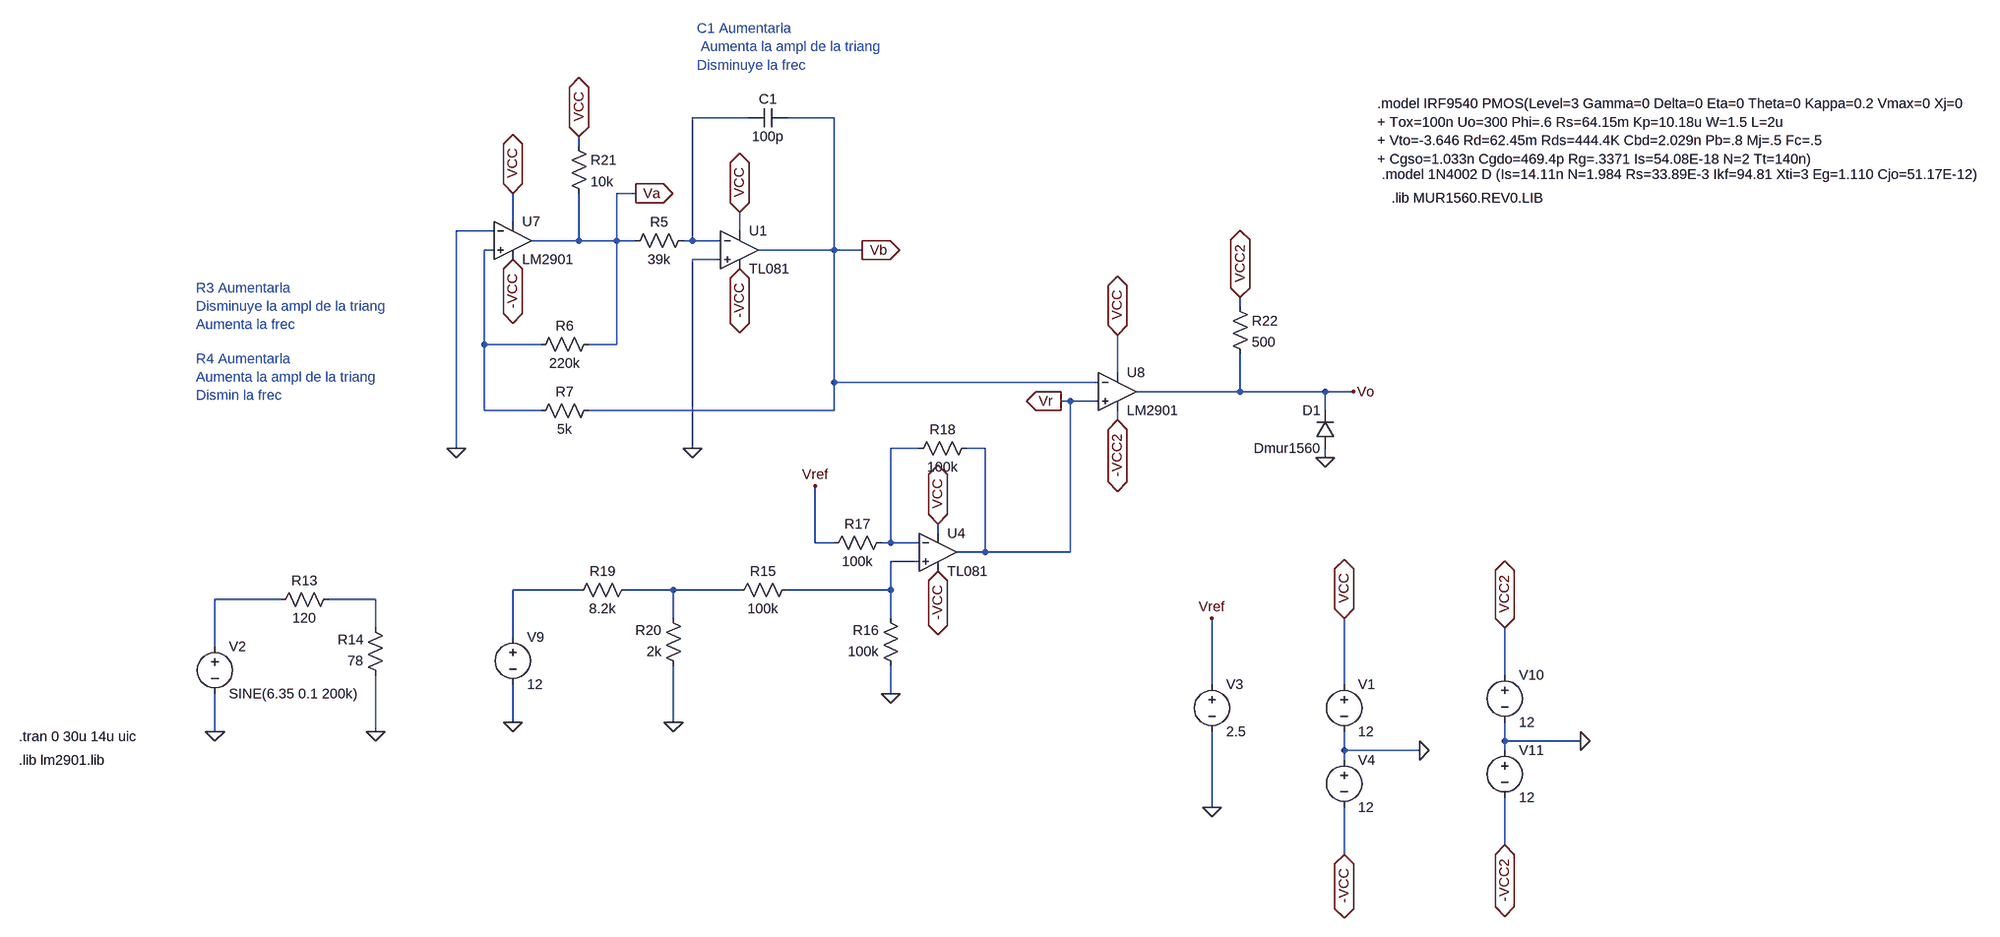
[diagram p0: schematic Ejemplo de modulador triangular en LTSPICE.asc]
Ejemplo de modulador triangular en LTSPICE.asc, the LTspice schematic file:
Version 4
SHEET 1 8976 680
WIRE 6784 -880 6688 -880
WIRE 6928 -880 6848 -880
WIRE 6496 -832 6496 -848
WIRE 6592 -752 6560 -752
WIRE 6384 -704 6384 -752
WIRE 6352 -688 6288 -688
WIRE 6768 -688 6768 -720
WIRE 6496 -672 6496 -752
WIRE 6496 -672 6416 -672
WIRE 6560 -672 6560 -752
WIRE 6560 -672 6496 -672
WIRE 6592 -672 6560 -672
WIRE 6688 -672 6688 -880
WIRE 6688 -672 6672 -672
WIRE 6736 -672 6688 -672
WIRE 6352 -656 6336 -656
WIRE 6928 -656 6928 -880
WIRE 6928 -656 6800 -656
WIRE 6976 -656 6928 -656
WIRE 6736 -640 6688 -640
WIRE 7616 -560 7616 -576
WIRE 6336 -496 6336 -656
WIRE 6432 -496 6336 -496
WIRE 6560 -496 6560 -672
WIRE 6560 -496 6512 -496
WIRE 7408 -448 7408 -512
WIRE 6928 -432 6928 -656
WIRE 7376 -432 6928 -432
WIRE 7616 -416 7616 -480
WIRE 7616 -416 7440 -416
WIRE 7760 -416 7616 -416
WIRE 7808 -416 7760 -416
WIRE 7328 -400 7312 -400
WIRE 7376 -400 7328 -400
WIRE 6336 -384 6336 -496
WIRE 6432 -384 6336 -384
WIRE 6928 -384 6928 -432
WIRE 6928 -384 6512 -384
WIRE 7760 -384 7760 -416
WIRE 7408 -368 7408 -384
WIRE 6288 -320 6288 -688
WIRE 6688 -320 6688 -640
WIRE 7072 -320 7024 -320
WIRE 7184 -320 7152 -320
WIRE 7760 -304 7760 -320
WIRE 7104 -176 7104 -192
WIRE 6896 -160 6896 -256
WIRE 6928 -160 6896 -160
WIRE 7024 -160 7024 -320
WIRE 7024 -160 7008 -160
WIRE 7072 -160 7024 -160
WIRE 7184 -144 7184 -320
WIRE 7184 -144 7136 -144
WIRE 7328 -144 7328 -400
WIRE 7328 -144 7184 -144
WIRE 7072 -128 7024 -128
WIRE 6496 -80 6384 -80
WIRE 6656 -80 6576 -80
WIRE 6768 -80 6656 -80
WIRE 7024 -80 7024 -128
WIRE 7024 -80 6848 -80
WIRE 5968 -64 5856 -64
WIRE 6128 -64 6048 -64
WIRE 6656 -32 6656 -80
WIRE 7024 -32 7024 -80
WIRE 6128 -16 6128 -64
WIRE 6384 0 6384 -80
WIRE 5856 16 5856 -64
WIRE 8064 64 8064 -16
WIRE 7568 80 7568 -32
WIRE 7792 80 7792 -32
WIRE 7024 96 7024 48
WIRE 6384 144 6384 80
WIRE 6656 144 6656 48
WIRE 5856 160 5856 96
WIRE 6128 160 6128 64
WIRE 8064 176 8064 144
WIRE 8192 176 8064 176
WIRE 7792 192 7792 160
WIRE 7920 192 7792 192
WIRE 8064 192 8064 176
WIRE 7792 208 7792 192
WIRE 7568 288 7568 160
WIRE 8064 352 8064 272
WIRE 7792 368 7792 288
FLAG 7792 -32 VCC
IOPIN 7792 -32 BiDir
FLAG 6384 -752 VCC
IOPIN 6384 -752 BiDir
FLAG 6768 -720 VCC
IOPIN 6768 -720 BiDir
FLAG 6592 -752 Va
IOPIN 6592 -752 Out
FLAG 6976 -656 Vb
IOPIN 6976 -656 Out
FLAG 5856 160 0
FLAG 7408 -512 VCC
IOPIN 7408 -512 BiDir
FLAG 7312 -400 Vr
IOPIN 7312 -400 Out
FLAG 6128 160 0
FLAG 7104 -192 VCC
IOPIN 7104 -192 BiDir
FLAG 7568 288 0
FLAG 7920 192 0
FLAG 7792 368 -VCC
IOPIN 7792 368 BiDir
FLAG 6288 -320 0
FLAG 6688 -320 0
FLAG 6384 -640 -VCC
IOPIN 6384 -640 BiDir
FLAG 6768 -624 -VCC
IOPIN 6768 -624 BiDir
FLAG 7568 -32 Vref
FLAG 6896 -256 Vref
FLAG 7104 -112 -VCC
IOPIN 7104 -112 BiDir
FLAG 7024 96 0
FLAG 6384 144 0
FLAG 6656 144 0
FLAG 6496 -848 VCC
IOPIN 6496 -848 BiDir
FLAG 8064 -16 VCC2
IOPIN 8064 -16 BiDir
FLAG 8192 176 0
FLAG 8064 352 -VCC2
IOPIN 8064 352 BiDir
FLAG 7616 -576 VCC2
IOPIN 7616 -576 BiDir
FLAG 7408 -368 -VCC2
IOPIN 7408 -368 BiDir
FLAG 7808 -416 Vo
FLAG 7760 -304 0
SYMBOL res 6688 -688 R90
WINDOW 0 0 56 VBottom 2
WINDOW 3 32 56 VTop 2
SYMATTR InstName R5
SYMATTR Value 39k
SYMBOL voltage 7792 64 R0
WINDOW 123 0 0 Left 0
WINDOW 39 0 0 Left 0
SYMATTR InstName V1
SYMATTR Value 12
SYMBOL res 6528 -512 R90
WINDOW 0 0 56 VBottom 2
WINDOW 3 32 56 VTop 2
SYMATTR InstName R6
SYMATTR Value 220k
SYMBOL res 6528 -400 R90
WINDOW 0 0 56 VBottom 2
WINDOW 3 32 56 VTop 2
SYMATTR InstName R7
SYMATTR Value 5k
SYMBOL voltage 5856 0 R0
WINDOW 123 0 0 Left 0
WINDOW 39 0 0 Left 0
SYMATTR InstName V2
SYMATTR Value SINE(6.35 0.1 200k)
SYMBOL cap 6848 -896 R90
WINDOW 0 0 32 VBottom 2
WINDOW 3 32 32 VTop 2
SYMATTR InstName C1
SYMATTR Value 100p
SYMBOL TL081 6768 -720 R0
SYMATTR InstName U1
SYMBOL res 6064 -80 R90
WINDOW 0 0 56 VBottom 2
WINDOW 3 32 56 VTop 2
SYMATTR InstName R13
SYMATTR Value 120
SYMBOL res 6144 80 R180
WINDOW 0 36 76 Left 2
WINDOW 3 36 40 Left 2
SYMATTR InstName R14
SYMATTR Value 78
SYMBOL TL081 7104 -208 R0
SYMATTR InstName U4
SYMBOL voltage 7568 64 R0
WINDOW 123 0 0 Left 0
WINDOW 39 0 0 Left 0
SYMATTR InstName V3
SYMATTR Value 2.5
SYMBOL voltage 7792 192 R0
WINDOW 123 0 0 Left 0
WINDOW 39 0 0 Left 0
SYMATTR InstName V4
SYMATTR Value 12
SYMBOL res 6864 -96 R90
WINDOW 0 0 56 VBottom 2
WINDOW 3 32 56 VTop 2
SYMATTR InstName R15
SYMATTR Value 100k
SYMBOL res 7040 64 R180
WINDOW 0 36 76 Left 2
WINDOW 3 36 40 Left 2
SYMATTR InstName R16
SYMATTR Value 100k
SYMBOL res 7024 -176 R90
WINDOW 0 0 56 VBottom 2
WINDOW 3 32 56 VTop 2
SYMATTR InstName R17
SYMATTR Value 100k
SYMBOL res 7168 -336 R90
WINDOW 0 0 56 VBottom 2
WINDOW 3 32 56 VTop 2
SYMATTR InstName R18
SYMATTR Value 100k
SYMBOL voltage 6384 -16 R0
WINDOW 123 0 0 Left 0
WINDOW 39 0 0 Left 0
SYMATTR InstName V9
SYMATTR Value 12
SYMBOL res 6592 -96 R90
WINDOW 0 0 56 VBottom 2
WINDOW 3 32 56 VTop 2
SYMATTR InstName R19
SYMATTR Value 8.2k
SYMBOL res 6672 64 R180
WINDOW 0 36 76 Left 2
WINDOW 3 36 40 Left 2
SYMATTR InstName R20
SYMATTR Value 2k
SYMBOL OpAmps\\opamp2 6384 -736 R0
SYMATTR InstName U7
SYMATTR Value LM2901
SYMBOL OpAmps\\opamp2 7408 -480 R0
SYMATTR InstName U8
SYMATTR Value LM2901
SYMBOL res 6480 -848 R0
SYMATTR InstName R21
SYMATTR Value 10k
SYMBOL voltage 8064 48 R0
WINDOW 123 0 0 Left 0
WINDOW 39 0 0 Left 0
SYMATTR InstName V10
SYMATTR Value 12
SYMBOL voltage 8064 176 R0
WINDOW 123 0 0 Left 0
WINDOW 39 0 0 Left 0
SYMATTR InstName V11
SYMATTR Value 12
SYMBOL res 7600 -576 R0
SYMATTR InstName R22
SYMATTR Value 500
SYMBOL diode 7776 -320 R180
WINDOW 0 24 64 Left 2
WINDOW 3 24 0 Left 2
SYMATTR InstName D1
SYMATTR Value Dmur1560
TEXT 5504 168 Left 2 !.tran 0 30u 14u uic
TEXT 7848 -904 Left 2 !.model IRF9540 PMOS(Level=3 Gamma=0 Delta=0 Eta=0 Theta=0 Kappa=0.2 Vmax=0 Xj=0\n+ Tox=100n Uo=300 Phi=.6 Rs=64.15m Kp=10.18u W=1.5 L=2u\n+ Vto=-3.646 Rd=62.45m Rds=444.4K Cbd=2.029n Pb=.8 Mj=.5 Fc=.5\n+ Cgso=1.033n Cgdo=469.4p Rg=.3371 Is=54.08E-18 N=2 Tt=140n)
TEXT 7856 -784 Left 2 !.model 1N4002 D (Is=14.11n N=1.984 Rs=33.89E-3 Ikf=94.81 Xti=3 Eg=1.110 Cjo=51.17E-12)
TEXT 5504 208 Left 2 !.lib lm2901.lib
TEXT 5824 -472 Left 2 ;R4 Aumentarla\nAumenta la ampl de la triang\nDismin la frec
TEXT 5824 -592 Left 2 ;R3 Aumentarla\nDisminuye la ampl de la triang\nAumenta la frec
TEXT 6696 -1032 Left 2 ;C1 Aumentarla\n Aumenta la ampl de la triang\nDisminuye la frec
TEXT 7872 -744 Left 2 !.lib MUR1560.REV0.LIB

The netlist it stands for:
* Ejemplo de modulador triangular en LTSPICE.asc
R5 N001 Va 39k
V1 VCC 0 12
R6 Va N002 220k
R7 Vb N002 5k
V2 N007 0 SINE(6.35 0.1 200k)
C1 Vb N001 100p
* U1: TL081 (symbol TL081 not available, pins judged from their places): In+=0 In-=N001 V+=VCC V-=-VCC OUT=Vb
R13 N008 N007 120
R14 0 N008 78
* U4: TL081 (symbol TL081 not available, pins judged from their places): In+=N004 In-=N003 V+=VCC V-=-VCC OUT=Vr
V3 Vref 0 2.5
V4 0 -VCC 12
R15 N004 N006 100k
R16 0 N004 100k
R17 N003 Vref 100k
R18 Vr N003 100k
V9 N005 0 12
R19 N006 N005 8.2k
R20 0 N006 2k
XU7 N002 0 VCC -VCC Va LM2901  ; pins In+ In- V+ V- OUT
XU8 Vr Vb VCC -VCC2 Vo LM2901  ; pins In+ In- V+ V- OUT
R21 VCC Va 10k
V10 VCC2 0 12
V11 0 -VCC2 12
R22 VCC2 Vo 500
D1 0 Vo Dmur1560
.model D D
.lib standard.dio
.tran 0 30u 14u uic
.model IRF9540 PMOS(Level=3 Gamma=0 Delta=0 Eta=0 Theta=0 Kappa=0.2 Vmax=0 Xj=0
+ Tox=100n Uo=300 Phi=.6 Rs=64.15m Kp=10.18u W=1.5 L=2u
+ Vto=-3.646 Rd=62.45m Rds=444.4K Cbd=2.029n Pb=.8 Mj=.5 Fc=.5
+ Cgso=1.033n Cgdo=469.4p Rg=.3371 Is=54.08E-18 N=2 Tt=140n)
.model 1N4002 D (Is=14.11n N=1.984 Rs=33.89E-3 Ikf=94.81 Xti=3 Eg=1.110 Cjo=51.17E-12)
.lib lm2901.lib
* R4 Aumentarla
* Aumenta la ampl de la triang
* Dismin la frec
* R3 Aumentarla
* Disminuye la ampl de la triang
* Aumenta la frec
* C1 Aumentarla
*  Aumenta la ampl de la triang
* Disminuye la frec
.lib MUR1560.REV0.LIB
.backanno
.end